# Altium schematic sheet MICROCONTROLLER.SchDoc
size A4
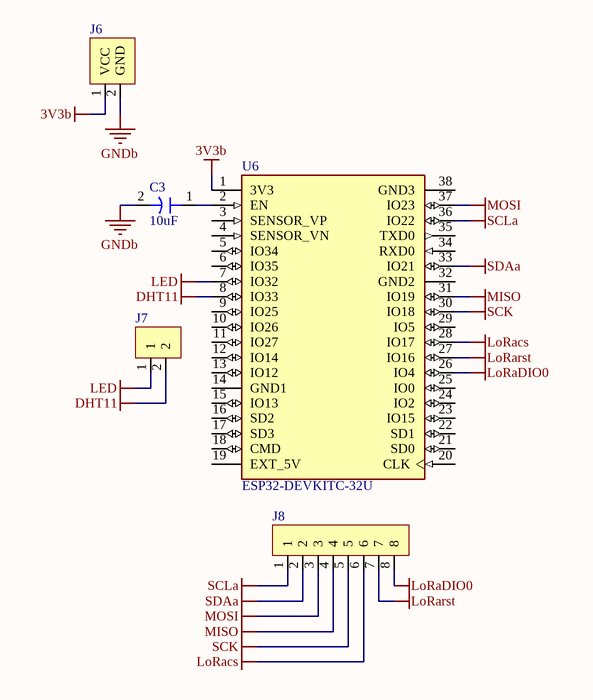
[diagram p0: MICROCONTROLLER.SchDoc]

## Parts
C3  10uF  [Electrolytic capacitor 2mm]
J6  PWR_CONNECTOR  [BATT]  (value not drawn)
J7  2x1_CONN  [CONN2x1_2.54mm]  (value not drawn)
J8  8x1 CONN  [CONN8x1_2.54]  (value not drawn)
U6  ESP32-DEVKITC-32U  [MODULE_ESP32-DEVKITC-32U]

## Nets
3V3b: J6.1(VCC) U6.1(3V3)
DHT11: J7.2 U6.8(IO33)
GNDb: C3.2(-) J6.2(GND)
LED: J7.1 U6.7(IO32)
LoRacs: J8.6 U6.28(IO17)
LoRaDIO0: J8.8 U6.26(IO4)
LoRarst: J8.7 U6.27(IO16)
MISO: J8.4 U6.31(IO19)
MOSI: J8.3 U6.37(IO23)
SCK: J8.5 U6.30(IO18)
SCLa: J8.1 U6.36(IO22)
SDAa: J8.2 U6.33(IO21)
NetC3_1: C3.1(+) U6.2(EN)

Not connected (* = marked no-connect by the designer): U6 3(SENSOR_VP) 4(SENSOR_VN) 5(IO34) 6(IO35) 9(IO25) 10(IO26) 11(IO27) 12(IO14) 13(IO12) 14(GND1) 15(IO13) 16(SD2) 17(SD3) 18(CMD) 19(EXT_5V) 20(CLK) 21(SD0) 22(SD1) 23(IO15) 24(IO2) 25(IO0) 29(IO5) 32(GND2) 34(RXD0) 35(TXD0) 38(GND3)

## Library data of the parts
C3 = E_CAP_10uF: Throug-hole 10uF
J6 = PWR-CONN: THT Connector
J7 = CONN 2x1: THT 2x1 2.54mm CONN
J8 = CONN 8x1: THT 8x1 2.54mm CONN
U6 = ESP32-DEVKITC-32U: ESP32-WROOM-32UE series Transceiver; 802.11 b/g/n (Wi-Fi, WiFi, WLAN), BluetoothÂ® Smart Ready 4.x Dual Mode Evaluation Board; MF: Espressif Systems; SnapEDA_Link: https://www.snapeda.com/parts/ESP32-DEVKITC-32U/Espressif+Systems/view-part/?ref=snap; Availability: In Stock; Purchase-URL: https://pricing.snapeda.com/search/part/ESP32-DEVKITC-32U/?ref=eda; Check_prices: https://www.snapeda.com/parts/ESP32-DEVKITC-32U/Espressif+Systems/view-part/?ref=eda; Value: *; Package: None; MP: ESP32-DEVKITC-32U; Price: None